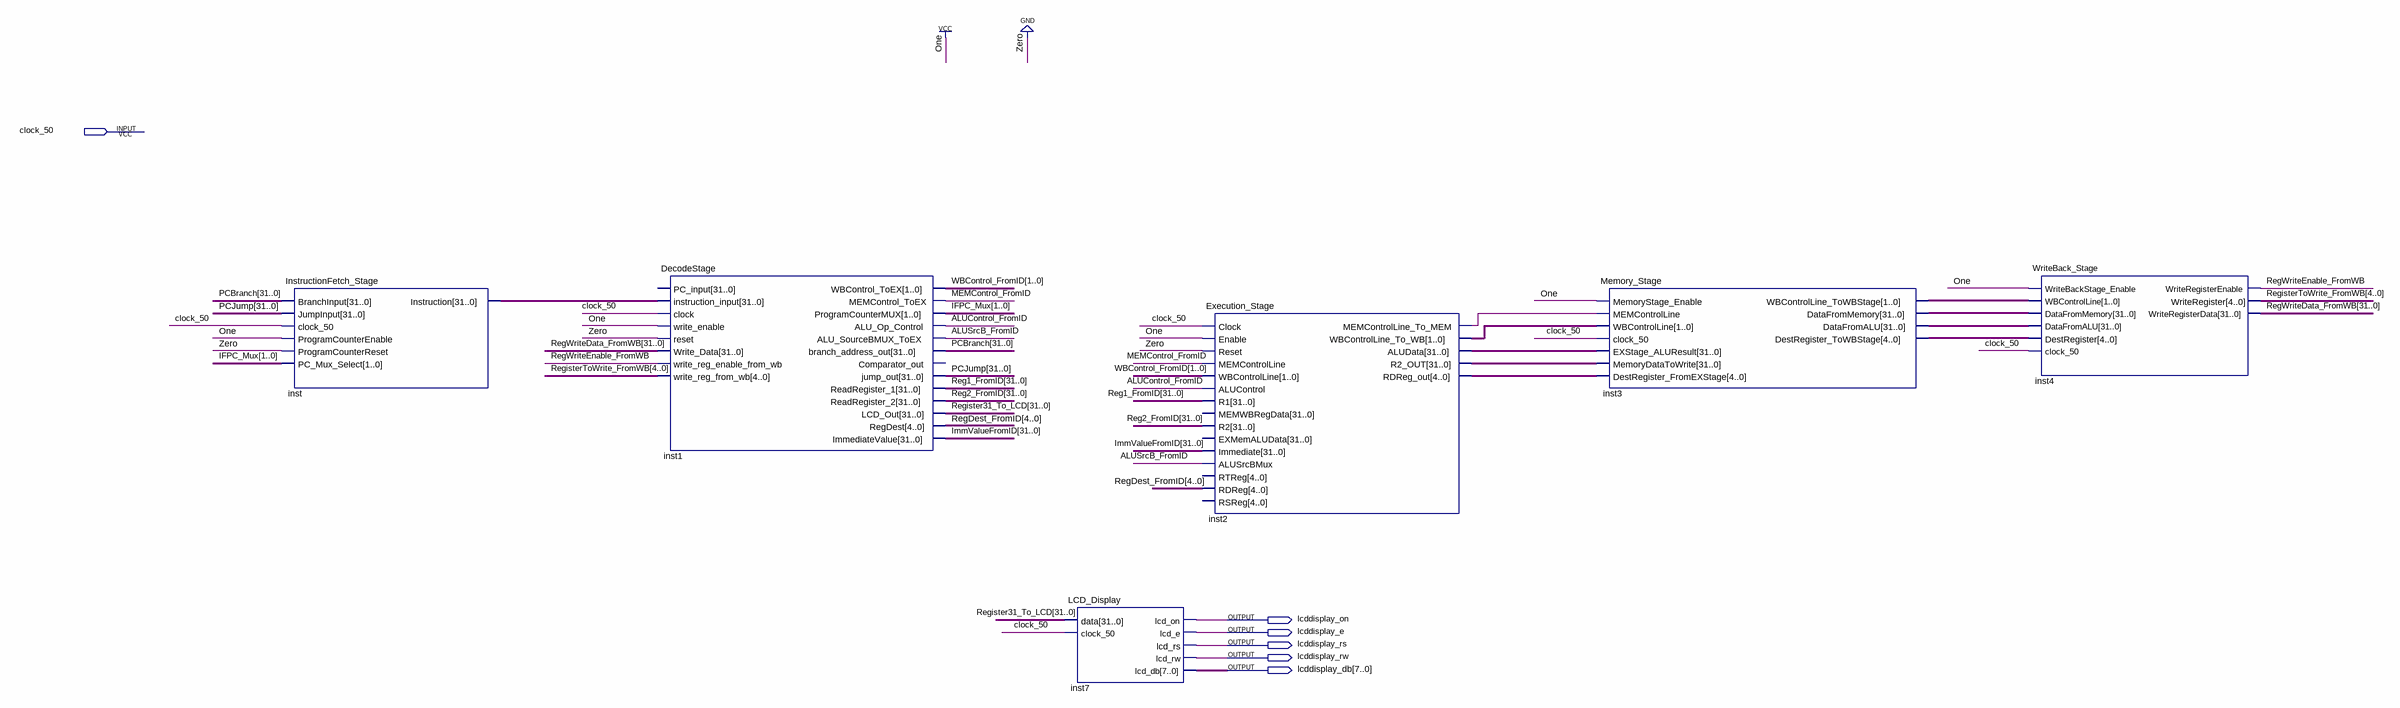
[diagram p0: schematic sheet]
// Quartus schematic CacheMoney.bdf as structural Verilog: 6 symbols, 6 pins
module CacheMoney (
  input  clock_50,
  output lcddisplay_on,
  output lcddisplay_e,
  output lcddisplay_rs,
  output lcddisplay_rw,
  output [7:0] lcddisplay_db
);

  wire ALUControl_FromID, ALUSrcB_FromID, inst2_memcontrolline_to_mem, MEMControl_FromID,
       RegWriteEnable_FromWB;
  wire [1:0] IFPC_Mux, inst2_wbcontrolline_to_wb, inst3_wbcontrolline_towbstage, WBControl_FromID;
  wire [4:0] inst2_rdreg_out, inst3_destregister_towbstage, RegDest_FromID, RegisterToWrite_FromWB;
  wire [31:0] ImmValueFromID, inst2_aludata, inst2_r2_out, inst3_datafromalu, inst3_datafrommemory,
       inst_instruction, PCBranch, PCJump, Reg1_FromID, Reg2_FromID, Register31_To_LCD, RegWriteData_FromWB;

  InstructionFetch_Stage inst (
    .BranchInput(PCBranch), .JumpInput(PCJump), .clock_50(clock_50), .ProgramCounterEnable(1'b1),
    .ProgramCounterReset(1'b0), .PC_Mux_Select(IFPC_Mux), .Instruction(inst_instruction));
  DecodeStage inst1 (
    .instruction_input(inst_instruction), .clock(clock_50), .write_enable(1'b1), .reset(1'b0),
    .Write_Data(RegWriteData_FromWB), .write_reg_enable_from_wb(RegWriteEnable_FromWB),
    .write_reg_from_wb(RegisterToWrite_FromWB), .WBControl_ToEX(WBControl_FromID),
    .MEMControl_ToEX(MEMControl_FromID), .ProgramCounterMUX(IFPC_Mux), .ALU_Op_Control(ALUControl_FromID),
    .ALU_SourceBMUX_ToEX(ALUSrcB_FromID), .branch_address_out(PCBranch), .jump_out(PCJump),
    .ReadRegister_1(Reg1_FromID), .ReadRegister_2(Reg2_FromID), .LCD_Out(Register31_To_LCD),
    .RegDest(RegDest_FromID), .ImmediateValue(ImmValueFromID));  // open: PC_input, Comparator_out
  LCD_Display inst7 (
    .data(Register31_To_LCD), .clock_50(clock_50), .lcd_on(lcddisplay_on), .lcd_e(lcddisplay_e),
    .lcd_rs(lcddisplay_rs), .lcd_rw(lcddisplay_rw), .lcd_db(lcddisplay_db));
  Execution_Stage inst2 (
    .Clock(clock_50), .Enable(1'b1), .Reset(1'b0), .MEMControlLine(MEMControl_FromID),
    .WBControlLine(WBControl_FromID), .ALUControl(ALUControl_FromID), .R1(Reg1_FromID), .R2(Reg2_FromID),
    .Immediate(ImmValueFromID), .ALUSrcBMux(ALUSrcB_FromID), .RDReg(RegDest_FromID),
    .MEMControlLine_To_MEM(inst2_memcontrolline_to_mem), .WBControlLine_To_WB(inst2_wbcontrolline_to_wb),
    .ALUData(inst2_aludata), .R2_OUT(inst2_r2_out), .RDReg_out(inst2_rdreg_out));  // open: MEMWBRegData, EXMemALUData, RTReg, RSReg
  Memory_Stage inst3 (
    .MemoryStage_Enable(1'b1), .MEMControlLine(inst2_memcontrolline_to_mem),
    .WBControlLine(inst2_wbcontrolline_to_wb), .clock_50(clock_50), .EXStage_ALUResult(inst2_aludata),
    .MemoryDataToWrite(inst2_r2_out), .DestRegister_FromEXStage(inst2_rdreg_out),
    .WBControlLine_ToWBStage(inst3_wbcontrolline_towbstage), .DataFromMemory(inst3_datafrommemory),
    .DataFromALU(inst3_datafromalu), .DestRegister_ToWBStage(inst3_destregister_towbstage));
  WriteBack_Stage inst4 (
    .WriteBackStage_Enable(1'b1), .WBControlLine(inst3_wbcontrolline_towbstage),
    .DataFromMemory(inst3_datafrommemory), .DataFromALU(inst3_datafromalu),
    .DestRegister(inst3_destregister_towbstage), .clock_50(clock_50),
    .WriteRegisterEnable(RegWriteEnable_FromWB), .WriteRegister(RegisterToWrite_FromWB),
    .WriteRegisterData(RegWriteData_FromWB));
endmodule
